# Altium schematic sheet 04_POWER_LDO.SchDoc
size A4
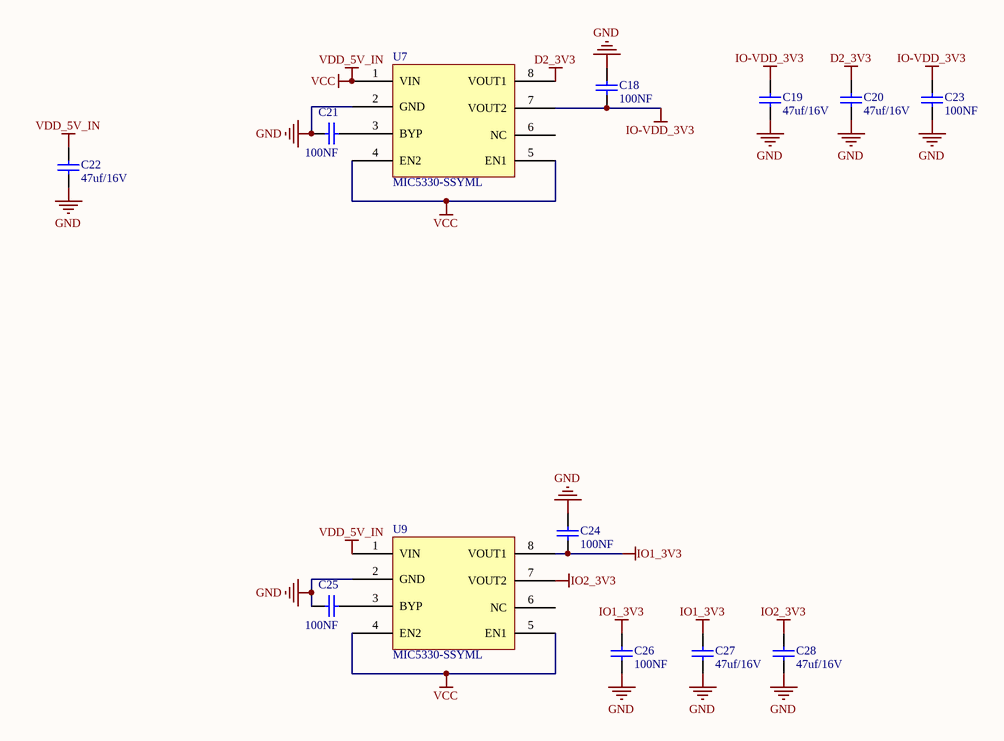
[diagram p0: 04_POWER_LDO.SchDoc]

## Parts
C18  100NF  [0402CAP]
C19  47uf/16V  [0805CAP]
C20  47uf/16V  [0805CAP]
C21  100NF  [0402CAP]
C22  47uf/16V  [0805CAP]
C23  100NF  [0402CAP]
C24  100NF  [0402CAP]
C25  100NF  [0402CAP]
C26  100NF  [0402CAP]
C27  47uf/16V  [0805CAP]
C28  47uf/16V  [0805CAP]
U7  MIC5330-SSYML  [MIC5530]
U9  MIC5330-SSYML  [MIC5530]

## Nets
D2_3V3: C20.1 U7.8(VOUT1)
GND: C18.2 C19.2 C20.2 C21.2 C22.2 C23.1 C24.2 C25.2 C26.1 C27.2 C28.2 U7.2(GND) U9.2(GND)
IO1_3V3: C24.1 C26.2 C27.1 U9.8(VOUT1)
IO2_3V3: C28.1 U9.7(VOUT2)
IO-VDD_3V3: C18.1 C19.1 C23.2 U7.7(VOUT2)
VCC: C22.1 U7.1(VIN) U7.4(EN2) U7.5(EN1) U9.1(VIN) U9.4(EN2) U9.5(EN1)  [also labelled VDD_5V_IN]
NetC21_1: C21.1 U7.3(BYP)
NetC25_1: C25.1 U9.3(BYP)

Not connected (* = marked no-connect by the designer): U7 6(NC); U9 6(NC)

## Library data of the parts
C18 C21 C24 C25 = Cap: Value: 100pF; Published: 8-Jun-2000; LatestRevisionDate: 17-Jul-2002; LatestRevisionNote: Re-released for DXP Platform.; PackageReference: RAD-0.3; Publisher: Altium Limited; PackageDescription: Radial Cap, Thru-Hole; 2 Leads; 0.3 in Pin Spacing
C19 C20 C22 C27 C28 = Cap: Capacitor
C23 C26 = Cap
U7 U9 = MIC5530